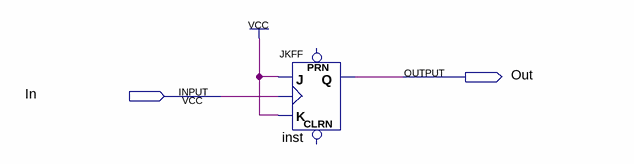
[diagram p0: schematic sheet]
// Quartus schematic Divizor_2.bdf as structural Verilog: 1 symbols, 2 pins
module Divizor_2 (
  input  In,
  output Out
);

  JKFF inst (.K(1'b1), .J(1'b1), .CLK(In), .Q(Out));  // open: PRN, CLRN
endmodule
